# Altium project Electro_plant.PrjPcb
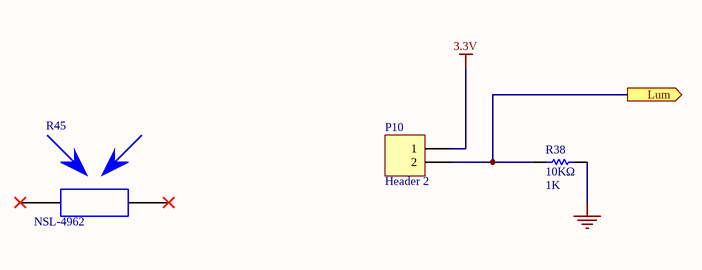
[diagram p0: LumSensor.SchDoc]
5 sheets, 52 parts. Net scope: flat (ports and power ports of the same name join across sheets).
Board file: PCB1.PcbDoc
Sheets:
  LumSensor.SchDoc
  PIC.SchDoc
  BarGraph.SchDoc
  Pump.SchDoc
  Power.SchDoc

## Sheet LumSensor.SchDoc
size A

### Parts
P10  Header 2  [BORNIER]
R38  10KΩ  value 1K  [R0603]
R45  NSL-4962

### Ports
Lum (out)

### Nets
3.3V: P10.1
GND: R38.2
NetP10_2: P10.2 R38.1 ; port Lum

Not connected (* = marked no-connect by the designer): R45 1* 2*

### Library data of the parts
P10 = Header 2: Header, 2-Pin; Manufacturer: BUCHANAN - TE CONNECTIVITY; Ref.Manufacturer: 282834-2; LatestRevisionDate: 17-Jul-2002; LatestRevisionNote: Re-released for DXP Platform.; Publisher: Altium Limited; Ref.Farnell: 2112482; Supplier: Farnell
R38 = Res1: Resistor; Manufacturer: MULTICOMP; Ref.Manufacturer: MC0063W0603110K; Published: 8-Jun-2000; LatestRevisionDate: 17-Jul-2002; LatestRevisionNote: Re-released for DXP Platform.; PackageReference: AXIAL-0.3; Publisher: Altium Limited; PackageDescription: Axial Device, Thru-Hole; 2 Leads; 0.3 in Pin Spacing; Ref.Farnell: 9330399; Supplier: Farnell
R45 = NSL-4962: Ldr; Manufacturer: ADVANCED PHOTONIX; Ref.Manufacturer: NSL 4962.; Ref.Farnell: 3168359; Supplier: Farnell

## Sheet PIC.SchDoc
size A
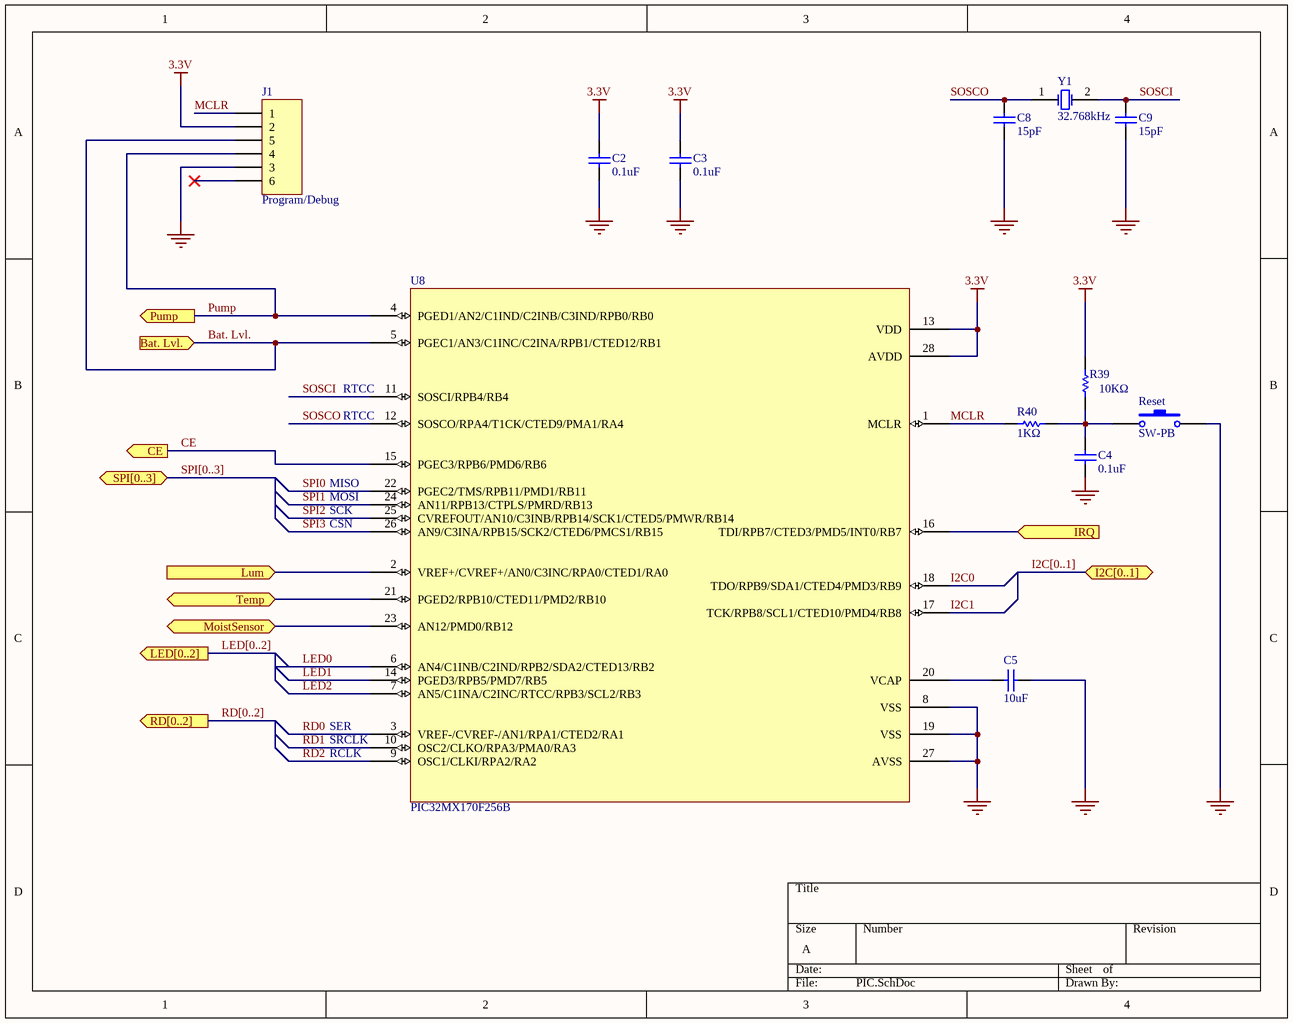
[diagram p1: PIC.SchDoc]

### Parts
C2  0.1uF  [C0603]
C3  0.1uF  [C0603]
C4  0.1uF  [C0603]
C5  10uF  [C0603]
C8  15pF  [C0603]
C9  15pF  [C0603]
J1  Program/Debug  [HDR1X6]
R39  10KΩ  [R0603]
R40  1KΩ  [R0603]
Reset  SW-PB  [Reset]
U8  PIC32MX170F256B  [PIC32MX170F256B]
Y1  32.768kHz  [XTAL]

### Ports
Bat. Lvl. (in), CE (out), I2C[0..1] (bidir), IRQ (in), LED[0..2] (out), Lum (in), MoistSensor (bidir), Pump (out), RD[0..2] (out), SPI[0..3] (bidir), Temp (bidir)

### Nets
3.3V: C2.2 C3.2 J1.2 R39.2 U8.13(VDD) U8.28(AVDD)
GND: C2.1 C3.1 C4.1 C5.2 C8.1 C9.1 J1.3 Reset.2 U8.8(VSS) U8.19(VSS) U8.27(AVSS)
Bat. Lvl.: J1.5 U8.5(PGEC1/AN3/C1INC/C2INA/RPB1/CTED12/RB1) ; port Bat. Lvl.
CE: U8.15(PGEC3/RPB6/PMD6/RB6) ; port CE
I2C0: U8.18(TDO/RPB9/SDA1/CTED4/PMD3/RB9)
I2C1: U8.17(TCK/RPB8/SCL1/CTED10/PMD4/RB8)
LED0: U8.6(AN4/C1INB/C2IND/RPB2/SDA2/CTED13/RB2)
LED1: U8.14(PGED3/RPB5/PMD7/RB5)
LED2: U8.7(AN5/C1INA/C2INC/RTCC/RPB3/SCL2/RB3)
MCLR: J1.1 R40.2 U8.1(MCLR)
Pump: J1.4 U8.4(PGED1/AN2/C1IND/C2INB/C3IND/RPB0/RB0) ; port Pump
RD0: U8.3(VREF-/CVREF-/AN1/RPA1/CTED2/RA1)
RD1: U8.10(OSC2/CLKO/RPA3/PMA0/RA3)
RD2: U8.9(OSC1/CLKI/RPA2/RA2)
SOSCI: C9.2 U8.11(SOSCI/RPB4/RB4) Y1.2(OSC2)
SOSCO: C8.2 U8.12(SOSCO/RPA4/T1CK/CTED9/PMA1/RA4) Y1.1(OSC1)
SPI0: U8.22(PGEC2/TMS/RPB11/PMD1/RB11)
SPI1: U8.24(AN11/RPB13/CTPLS/PMRD/RB13)
SPI2: U8.25(CVREFOUT/AN10/C3INB/RPB14/SCK1/CTED5/PMWR/RB14)
SPI3: U8.26(AN9/C3INA/RPB15/SCK2/CTED6/PMCS1/RB15)
NetC4_2: C4.2 R39.1 R40.1 Reset.1
NetC5_1: C5.1 U8.20(VCAP)
NetP10_2: U8.2(VREF+/CVREF+/AN0/C3INC/RPA0/CTED1/RA0) ; port Lum
NetU8_16: U8.16(TDI/RPB7/CTED3/PMD5/INT0/RB7) ; port IRQ
NetU8_21: U8.21(PGED2/RPB10/CTED11/PMD2/RB10) ; port Temp
NetU8_23: U8.23(AN12/PMD0/RB12) ; port MoistSensor

Not connected (* = marked no-connect by the designer): J1 6*

### Buses and harness runs
bus I2C[0..1] = port I2C[0..1]
bus LED[0..2] = port LED[0..2]
bus RD[0..2] = port RD[0..2]
bus SPI[0..3] = port SPI[0..3]

### Notes on the sheet
- (near U8) RTCC
- MISO
- MOSI
- SCK
- CSN
- SER
- RCLK
- (near U8) SRCLK

### Library data of the parts
C2-C4 = Cap: Capacitor; Manufacturer: MURATA; Ref.Manufacturer: GRM188R71H104KA93; Value: 100pF; Published: 8-Jun-2000; LatestRevisionDate: 17-Jul-2002; LatestRevisionNote: Re-released for DXP Platform.; PackageReference: RAD-0.3; Publisher: Altium Limited; PackageDescription: Radial Cap, Thru-Hole; 2 Leads; 0.3 in Pin Spacing; Ref.Farnell: 8820023; Supplier: Farnell
C5 = Cap: Capacitor; Manufacturer: MURATA; Ref.Manufacturer: GRM188D71A106MA73; Value: 100pF; Published: 8-Jun-2000; LatestRevisionDate: 17-Jul-2002; LatestRevisionNote: Re-released for DXP Platform.; PackageReference: RAD-0.3; Publisher: Altium Limited; PackageDescription: Radial Cap, Thru-Hole; 2 Leads; 0.3 in Pin Spacing; Ref.Farnell: 2611920; Supplier: Farnell
C8 C9 = Cap: Capacitor; Manufacturer: MURATA; Ref.Manufacturer: GRM1885C1H150JA01; Value: 27pF; Published: 8-Jun-2000; LatestRevisionDate: 17-Jul-2002; LatestRevisionNote: Re-released for DXP Platform.; PackageReference: RAD-0.3; Publisher: Altium Limited; PackageDescription: Radial Cap, Thru-Hole; 2 Leads; 0.3 in Pin Spacing; Ref.Farnell: 8819823; Supplier: Farnell
J1 = Header 6: Header, 6-Pin; LatestRevisionDate: 17-Jul-2002; LatestRevisionNote: Re-released for DXP Platform.; Publisher: Altium Limited; Supplier: Farnell
R39 = Res1: Resistor; Manufacturer: MULTICOMP; Ref.Manufacturer: MC0063W0603110K; Value: 1K; Published: 8-Jun-2000; LatestRevisionDate: 17-Jul-2002; LatestRevisionNote: Re-released for DXP Platform.; PackageReference: AXIAL-0.3; Publisher: Altium Limited; PackageDescription: Axial Device, Thru-Hole; 2 Leads; 0.3 in Pin Spacing; Ref.Farnell: 9330399; Supplier: Farnell
R40 = Res1: Resistor; Manufacturer: MULTICOMP; Ref.Manufacturer: MC0063W060311K; Value: 1K; Published: 8-Jun-2000; LatestRevisionDate: 17-Jul-2002; LatestRevisionNote: Re-released for DXP Platform.; PackageReference: AXIAL-0.3; Publisher: Altium Limited; PackageDescription: Axial Device, Thru-Hole; 2 Leads; 0.3 in Pin Spacing; Ref.Farnell: 9330380; Supplier: Farnell
Reset = SW-PB: Switch; Manufacturer: ALCOSWITCH - TE CONNECTIVITY; Ref.Manufacturer: 1437566-3; Published: 24-Mar-1999; LatestRevisionDate: 17-Jul-2002; LatestRevisionNote: Re-released for DXP Platform.; PackageReference: SPST-2; Publisher: Altium Limited; PackageDescription: Switch; 2 Leads; Ref.Farnell: 2468741; Supplier: Farnell
U8 = PIC32MX170F256B: Pic; Manufacturer: MICROCHIP; Ref.Manufacturer: PIC32MX170F256B-I/SO; Ref.Farnell: 2449077; Supplier: Farnell
Y1 = XTAL: Crystal Oscillator; Manufacturer: ABRACON; Ref.Manufacturer: AB38T-32.768KHZ; Published: 8-Jun-2000; LatestRevisionDate: 17-Jul-2002; LatestRevisionNote: Re-released for DXP Platform.; PackageReference: R38; Publisher: Altium Limited; PackageDescription: Crystal, Thru-Hole; 2 Leads; Body 3.1 x 8.2 mm (Dia.xH); Ref.Farnell: 1611828; Supplier: Farnell

## Sheet BarGraph.SchDoc
size A
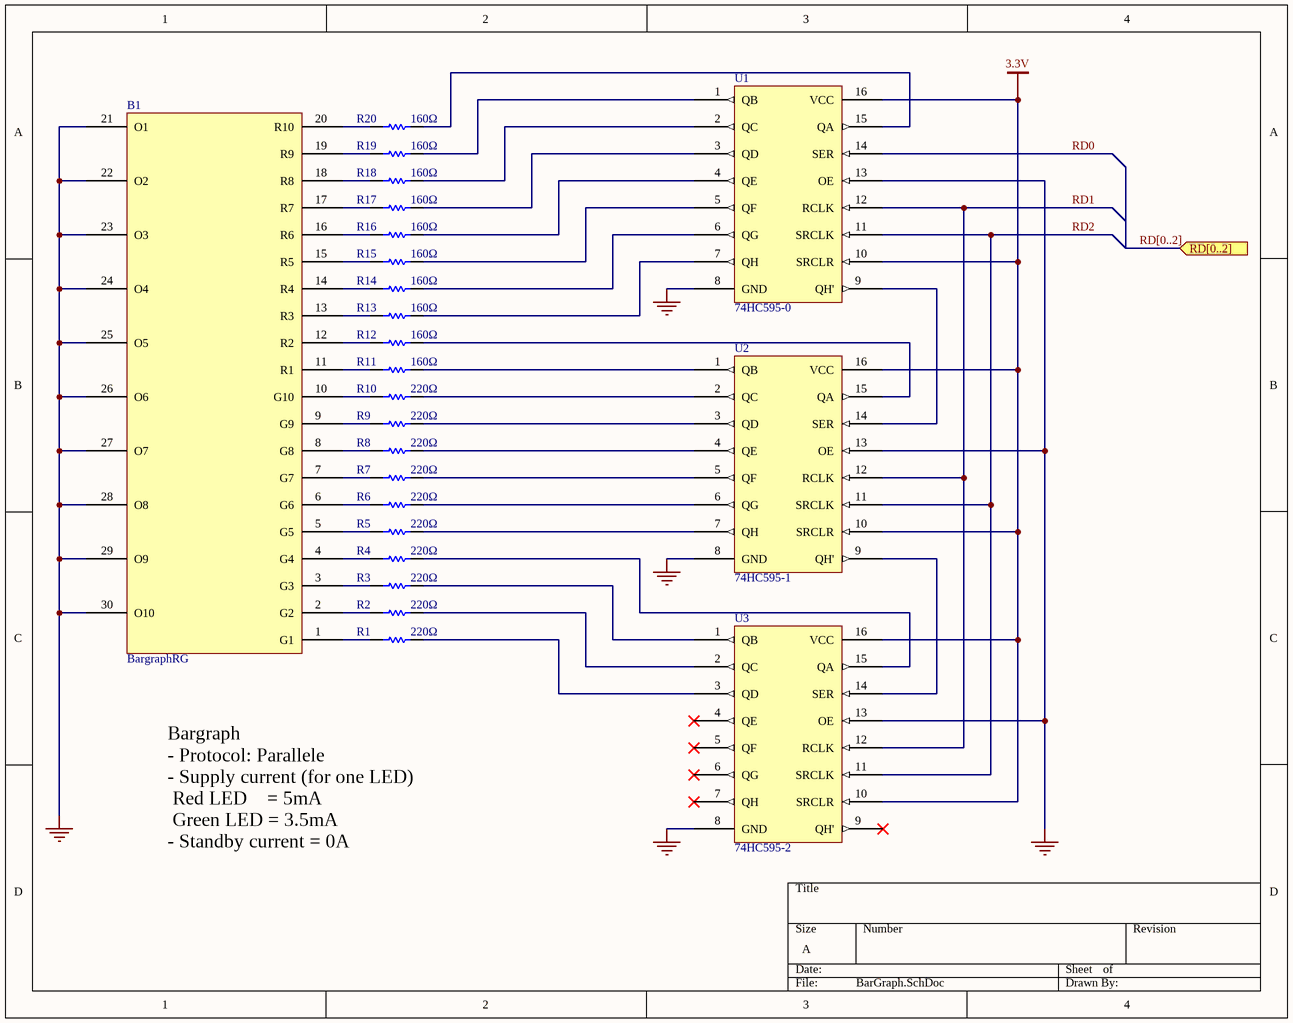
[diagram p2: BarGraph.SchDoc]

### Parts
B1  BargraphRG  [BargraphRG]
R1  220Ω  [R0603]
R2  220Ω  [R0603]
R3  220Ω  [R0603]
R4  220Ω  [R0603]
R5  220Ω  [R0603]
R6  220Ω  [R0603]
R7  220Ω  [R0603]
R8  220Ω  [R0603]
R9  220Ω  [R0603]
R10  220Ω  [R0603]
R11  160Ω  [R0603]
R12  160Ω  [R0603]
R13  160Ω  [R0603]
R14  160Ω  [R0603]
R15  160Ω  [R0603]
R16  160Ω  [R0603]
R17  160Ω  [R0603]
R18  160Ω  [R0603]
R19  160Ω  [R0603]
R20  160Ω  [R0603]
U1  74HC595-0  [SN74HC595D]
U2  74HC595-1  [SN74HC595D]
U3  74HC595-2  [SN74HC595D]

### Ports
RD[0..2] (in)

### Nets
3.3V: U1.10(SRCLR) U1.16(VCC) U2.10(SRCLR) U2.16(VCC) U3.10(SRCLR) U3.16(VCC)
GND: B1.21(O1) B1.22(O2) B1.23(O3) B1.24(O4) B1.25(O5) B1.26(O6) B1.27(O7) B1.28(O8) B1.29(O9) B1.30(O10) U1.8(GND) U1.13(OE) U2.8(GND) U2.13(OE) U3.8(GND) U3.13(OE)
RD0: U1.14(SER)
RD1: U1.12(RCLK) U2.12(RCLK) U3.12(RCLK)
RD2: U1.11(SRCLK) U2.11(SRCLK) U3.11(SRCLK)
NetB1_1: B1.1(G1) R1.1
NetB1_2: B1.2(G2) R2.1
NetB1_3: B1.3(G3) R3.1
NetB1_4: B1.4(G4) R4.1
NetB1_5: B1.5(G5) R5.1
NetB1_6: B1.6(G6) R6.1
NetB1_7: B1.7(G7) R7.1
NetB1_8: B1.8(G8) R8.1
NetB1_9: B1.9(G9) R9.1
NetB1_10: B1.10(G10) R10.1
NetB1_11: B1.11(R1) R11.1
NetB1_12: B1.12(R2) R12.1
NetB1_13: B1.13(R3) R13.1
NetB1_14: B1.14(R4) R14.1
NetB1_15: B1.15(R5) R15.1
NetB1_16: B1.16(R6) R16.1
NetB1_17: B1.17(R7) R17.1
NetB1_18: B1.18(R8) R18.1
NetB1_19: B1.19(R9) R19.1
NetB1_20: B1.20(R10) R20.1
NetR1_2: R1.2 U3.3(QD)
NetR2_2: R2.2 U3.2(QC)
NetR3_2: R3.2 U3.1(QB)
NetR4_2: R4.2 U3.15(QA)
NetR5_2: R5.2 U2.7(QH)
NetR6_2: R6.2 U2.6(QG)
NetR7_2: R7.2 U2.5(QF)
NetR8_2: R8.2 U2.4(QE)
NetR9_2: R9.2 U2.3(QD)
NetR10_2: R10.2 U2.2(QC)
NetR11_2: R11.2 U2.1(QB)
NetR12_2: R12.2 U2.15(QA)
NetR13_2: R13.2 U1.7(QH)
NetR14_2: R14.2 U1.6(QG)
NetR15_2: R15.2 U1.5(QF)
NetR16_2: R16.2 U1.4(QE)
NetR17_2: R17.2 U1.3(QD)
NetR18_2: R18.2 U1.2(QC)
NetR19_2: R19.2 U1.1(QB)
NetR20_2: R20.2 U1.15(QA)
NetU1_9: U1.9(QH') U2.14(SER)
NetU2_9: U2.9(QH') U3.14(SER)

Not connected (* = marked no-connect by the designer): U3 4(QE)* 5(QF)* 6(QG)* 7(QH)* 9(QH')*

### Buses and harness runs
bus RD[0..2] = port RD[0..2]

### Notes on the sheet
- Bargraph
  - Protocol: Parallele
  - Supply current (for one LED)
  Red LED    = 5mA
  Green LED = 3.5mA
  - Standby current = 0A

### Library data of the parts
B1 = BargraphRG: Bargraph; Manufacturer: KINGBRIGHT; Ref.Manufacturer: DC-10EGWA; Ref.Farnell: 2290326; Supplier: Farnell
R1-R10 = Res1: Resistor; Manufacturer: MULTICOMP; Ref.Manufacturer: MC0063W06031220R; Value: 1K; Published: 8-Jun-2000; LatestRevisionDate: 17-Jul-2002; LatestRevisionNote: Re-released for DXP Platform.; PackageReference: AXIAL-0.3; Publisher: Altium Limited; PackageDescription: Axial Device, Thru-Hole; 2 Leads; 0.3 in Pin Spacing; Ref.Farnell: 9330801; Supplier: Farnell
R11-R20 = Res1: Resistor; Manufacturer: MULTICOMP; Ref.Manufacturer: MC0063W06031160R; Value: 1K; Published: 8-Jun-2000; LatestRevisionDate: 17-Jul-2002; LatestRevisionNote: Re-released for DXP Platform.; PackageReference: AXIAL-0.3; Publisher: Altium Limited; PackageDescription: Axial Device, Thru-Hole; 2 Leads; 0.3 in Pin Spacing; Ref.Farnell: 9330658; Supplier: Farnell
U1-U3 = 74HC595: ShiftRegister; Manufacturer: TEXAS INSTRUMENTS; Ref.Manufacturer: SN74HC595DR; Ref.Farnell: 1607849; Supplier: Farnell

## Sheet Pump.SchDoc
size A
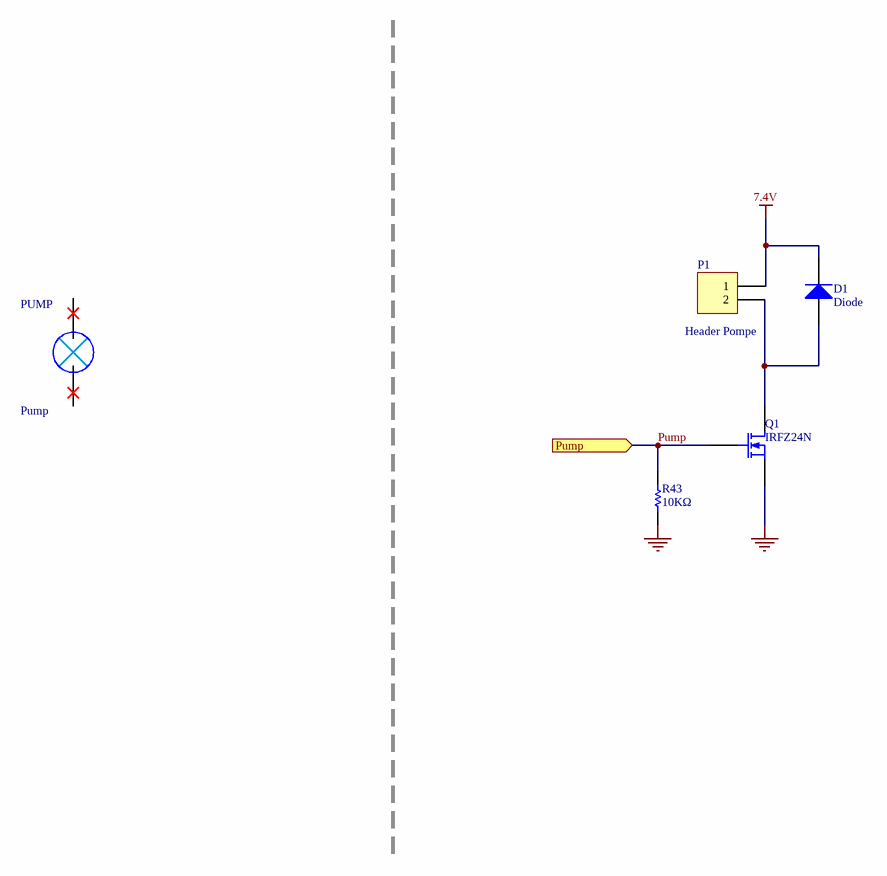
[diagram p3: Pump.SchDoc]

### Parts
D1  Diode  [DO-219AB]
P1  Header Pompe  [BORNIER]
PUMP  Pump
Q1  IRFZ24N  [TO-220AB]
R43  10KΩ  [R0603]

### Ports
Pump (in)

### Nets
7.4V: D1.2(K) P1.1
GND: Q1.3(S) R43.2
Pump: Q1.2(G) R43.1 ; port Pump
NetD1_1: D1.1(A) P1.2 Q1.1(D)

Not connected (* = marked no-connect by the designer): PUMP 1 2

### Library data of the parts
P1 = Header 2: as P10 on sheet LumSensor; LatestRevisionDate: 17-Jul-2002; LatestRevisionNote: Re-released for DXP Platform.; Publisher: Altium Limited; Ref.Farnell: 2112482; Supplier: Farnell
PUMP = Pump: Manufacturer: /; Ref.Farnell: /; Ref.Manufacturer: /; Supplier: /
Q1 = MOSFET-N: N-Channel MOSFET; Manufacturer: INFINEON; Ref.Manufacturer: IRFZ24NPBF; Published: 8-Jun-2000; LatestRevisionDate: 17-Jul-2002; LatestRevisionNote: Re-released for DXP Platform.; PackageVersion: 1995/1996; PackageReference: E3; Publisher: Altium Limited; PackageDescription: TO, Flat Index; 3 In-Line, Axial Leads; Body Dia. 4.6mm; Lead Dia. 0.5 mm (max); Ref.Farnell: 8650160; Supplier: Farnell
R43 = Res1: as R39 on sheet PIC; Published: 8-Jun-2000; LatestRevisionDate: 17-Jul-2002; LatestRevisionNote: Re-released for DXP Platform.; PackageReference: AXIAL-0.3; Publisher: Altium Limited; PackageDescription: Axial Device, Thru-Hole; 2 Leads; 0.3 in Pin Spacing; Ref.Farnell: 9330399; Supplier: Farnell
D1 = Diode: Published: 8-Jun-2000; LatestRevisionDate: 17-Jul-2002; LatestRevisionNote: Re-released for DXP Platform.; PackageVersion: Sep-1996; PackageReference: SMC; Publisher: Altium Limited; PackageDescription: DO-214-AB/SMC; 2 C-Bend Leads; Body 7.9 x 5.9 mm, inc. leads (LxW); Code_JEDEC: DO-214-AB; Supplier: Farnell

## Sheet Power.SchDoc
size A
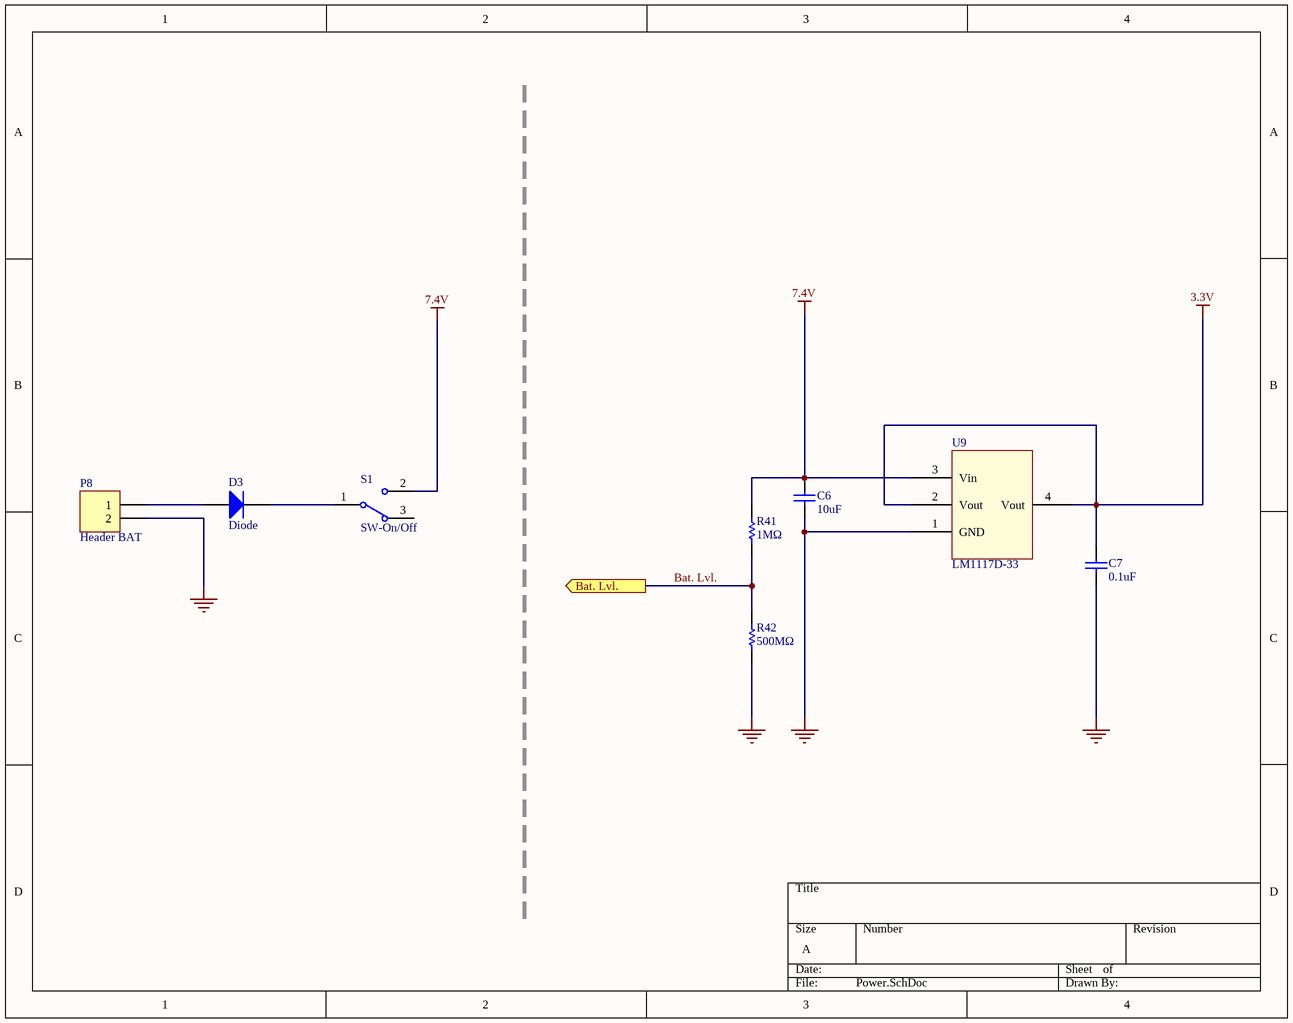
[diagram p4: Power.SchDoc]

### Parts
C6  10uF  [C0603]
C7  0.1uF  [C0603]
D3  Diode  [DO-219AB]
P8  Header BAT  [BORNIER]
R41  1MΩ  [R0603]
R42  500MΩ  [R0603]
S1  SW-On/Off  [Switch on/off]
U9  LM1117D-33  [VoltReg3.3V]

### Ports
Bat. Lvl. (out)

### Nets
3.3V: C7.2 U9.2(Vout) U9.4(Vout)
7.4V: C6.2 R41.2 S1.2 U9.3(Vin)
GND: C6.1 C7.1 P8.2 R42.1 U9.1(GND)
Bat. Lvl.: R41.1 R42.2 ; port Bat. Lvl.
NetD3_1: D3.1(A) P8.1
NetD3_2: D3.2(K) S1.1

Not connected (* = marked no-connect by the designer): S1 3

### Library data of the parts
C6 = Cap: as C5 on sheet PIC; Published: 8-Jun-2000; LatestRevisionDate: 17-Jul-2002; LatestRevisionNote: Re-released for DXP Platform.; PackageReference: RAD-0.3; Publisher: Altium Limited; PackageDescription: Radial Cap, Thru-Hole; 2 Leads; 0.3 in Pin Spacing; Ref.Farnell: 2611920; Supplier: Farnell
C7 = Cap: Capacitor; Manufacturer: MURATA; Ref.Manufacturer: ?/GRM188R71H104KA93; Value: 100pF; Published: 8-Jun-2000; LatestRevisionDate: 17-Jul-2002; LatestRevisionNote: Re-released for DXP Platform.; PackageReference: RAD-0.3; Publisher: Altium Limited; PackageDescription: Radial Cap, Thru-Hole; 2 Leads; 0.3 in Pin Spacing; Ref.Farnell: ?/8820023; Supplier: Farnell
P8 = Header 2: as P10 on sheet LumSensor; LatestRevisionDate: 17-Jul-2002; LatestRevisionNote: Re-released for DXP Platform.; Publisher: Altium Limited; Ref.Farnell: 2112482; Supplier: Farnell
R41 = Res1: Resistor; Manufacturer: MULTICOMP; Value: 1K; Published: 8-Jun-2000; LatestRevisionDate: 17-Jul-2002; LatestRevisionNote: Re-released for DXP Platform.; PackageReference: AXIAL-0.3; Publisher: Altium Limited; PackageDescription: Axial Device, Thru-Hole; 2 Leads; 0.3 in Pin Spacing; Ref.Farnell: ?; Supplier: Farnell
R42 = Res1: Resistor; Manufacturer: MULTICOMP; Ref.Manufacturer: MC0063W060311M; Value: 1K; Published: 8-Jun-2000; LatestRevisionDate: 17-Jul-2002; LatestRevisionNote: Re-released for DXP Platform.; PackageReference: AXIAL-0.3; Publisher: Altium Limited; PackageDescription: Axial Device, Thru-Hole; 2 Leads; 0.3 in Pin Spacing; Ref.Farnell: 9330410; Supplier: Farnell
S1 = SW-SPDT: SPDT Subminiature Toggle Switch, Right Angle Mounting, Vertical Actuation; Manufacturer: EOZ; Ref.Manufacturer: 09.03201.02; Published: 24-Mar-1999; LatestRevisionDate: 17-Dec-2003; LatestRevisionNote: Schematic revised, PCB Footprint replaced.; DatasheetVersion: 05-Dec-2000; PackageReference: TL36WW15050; Publisher: Altium Limited; PackageDescription: Switch; 4 Leads; ComponentLink1Description: Manufacturer Link; ComponentLink1URL: http://www.apem.com; Ref.Farnell: 1608080; Supplier: Farnell
U9 = LM1117D-33: Battery; Manufacturer: TEXAS INSTRUMENTS; Ref.Manufacturer: LM1117T-3.3/NOPB; Ref.Farnell: 1469056; Supplier: Farnell
D3 = Diode: Published: 8-Jun-2000; LatestRevisionDate: 17-Jul-2002; LatestRevisionNote: Re-released for DXP Platform.; PackageVersion: Sep-1996; PackageReference: SMC; Publisher: Altium Limited; PackageDescription: DO-214-AB/SMC; 2 C-Bend Leads; Body 7.9 x 5.9 mm, inc. leads (LxW); Code_JEDEC: DO-214-AB; Supplier: Farnell

## Nets that join several sheets
3.3V: LumSensor (P10.1), PIC (6 pins), BarGraph (6 pins), Power (C7.2 U9.2 U9.4)
7.4V: Pump (D1.2 P1.1), Power (C6.2 R41.2 S1.2 U9.3)
GND: LumSensor (R38.2), PIC (11 pins), BarGraph (16 pins), Pump (Q1.3 R43.2), Power (5 pins)
Bat. Lvl.: PIC (J1.5 U8.5), Power (R41.1 R42.2)
NetP10_2: LumSensor (P10.2 R38.1), PIC (U8.2)
Pump: PIC (J1.4 U8.4), Pump (Q1.2 R43.1)
RD0: PIC (U8.3), BarGraph (U1.14)
RD1: PIC (U8.10), BarGraph (U1.12 U2.12 U3.12)
RD2: PIC (U8.9), BarGraph (U1.11 U2.11 U3.11)